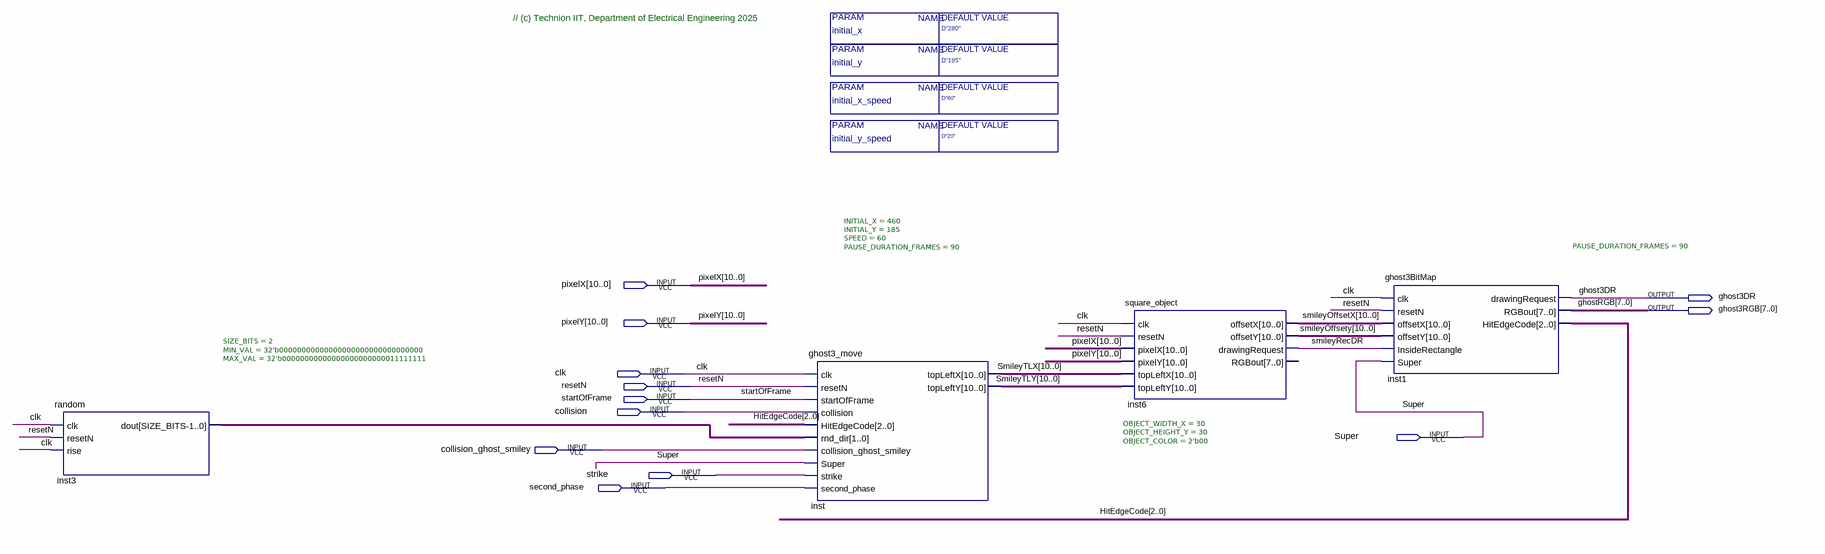
[diagram p0: schematic sheet]
// Quartus schematic Ghost_Block_T3.bdf as structural Verilog: 4 symbols, 12 pins
module Ghost_Block_T3 #(parameter initial_x = "D\"280\"", parameter initial_y = "D\"185\"", parameter initial_x_speed = "D\"60\"", parameter initial_y_speed = "D\"20\"") (
  input  [10:0] pixelX,
  input  [10:0] pixelY,
  input  clk,
  input  resetN,
  input  startOfFrame,
  input  collision,
  input  Super,
  input  collision_ghost_smiley,
  input  strike,
  input  second_phase,
  output ghost3DR,
  output [7:0] ghost3RGB
);

  wire smileyRecDR;
  wire [1:0] inst3_dout;
  wire [2:0] HitEdgeCode;
  wire [10:0] smileyOffsetX, smileyOffsety, SmileyTLX, SmileyTLY;

  random #(.SIZE_BITS(2), .MIN_VAL(32'b00000000000000000000000000000000), .MAX_VAL(32'b00000000000000000000000011111111)) inst3 (
    .clk(clk), .resetN(resetN), .rise(clk), .dout(inst3_dout));
  ghost3_move #(.INITIAL_X(460), .INITIAL_Y(185), .SPEED(60), .PAUSE_DURATION_FRAMES(90)) inst (
    .clk(clk), .resetN(resetN), .startOfFrame(startOfFrame), .collision(collision),
    .HitEdgeCode(HitEdgeCode), .rnd_dir(inst3_dout), .collision_ghost_smiley(collision_ghost_smiley),
    .Super(Super), .strike(strike), .second_phase(second_phase), .topLeftX(SmileyTLX), .topLeftY(SmileyTLY));
  square_object #(.OBJECT_WIDTH_X(30), .OBJECT_HEIGHT_Y(30), .OBJECT_COLOR(2'b00)) inst6 (
    .clk(clk), .resetN(resetN), .pixelX(pixelX), .pixelY(pixelY), .topLeftX(SmileyTLX), .topLeftY(SmileyTLY),
    .offsetX(smileyOffsetX), .offsetY(smileyOffsety), .drawingRequest(smileyRecDR));  // open: RGBout
  ghost3BitMap #(.PAUSE_DURATION_FRAMES(90)) inst1 (
    .clk(clk), .resetN(resetN), .offsetX(smileyOffsetX), .offsetY(smileyOffsety),
    .InsideRectangle(smileyRecDR), .Super(Super), .drawingRequest(ghost3DR), .RGBout(ghost3RGB),
    .HitEdgeCode(HitEdgeCode));

  // Other names for the same wires on the sheet: ghostRGB[7:0] = ghost3RGB

  // Notes on the sheet:
  //   // (c) Technion IIT, Department of Electrical Engineering 2025
endmodule
